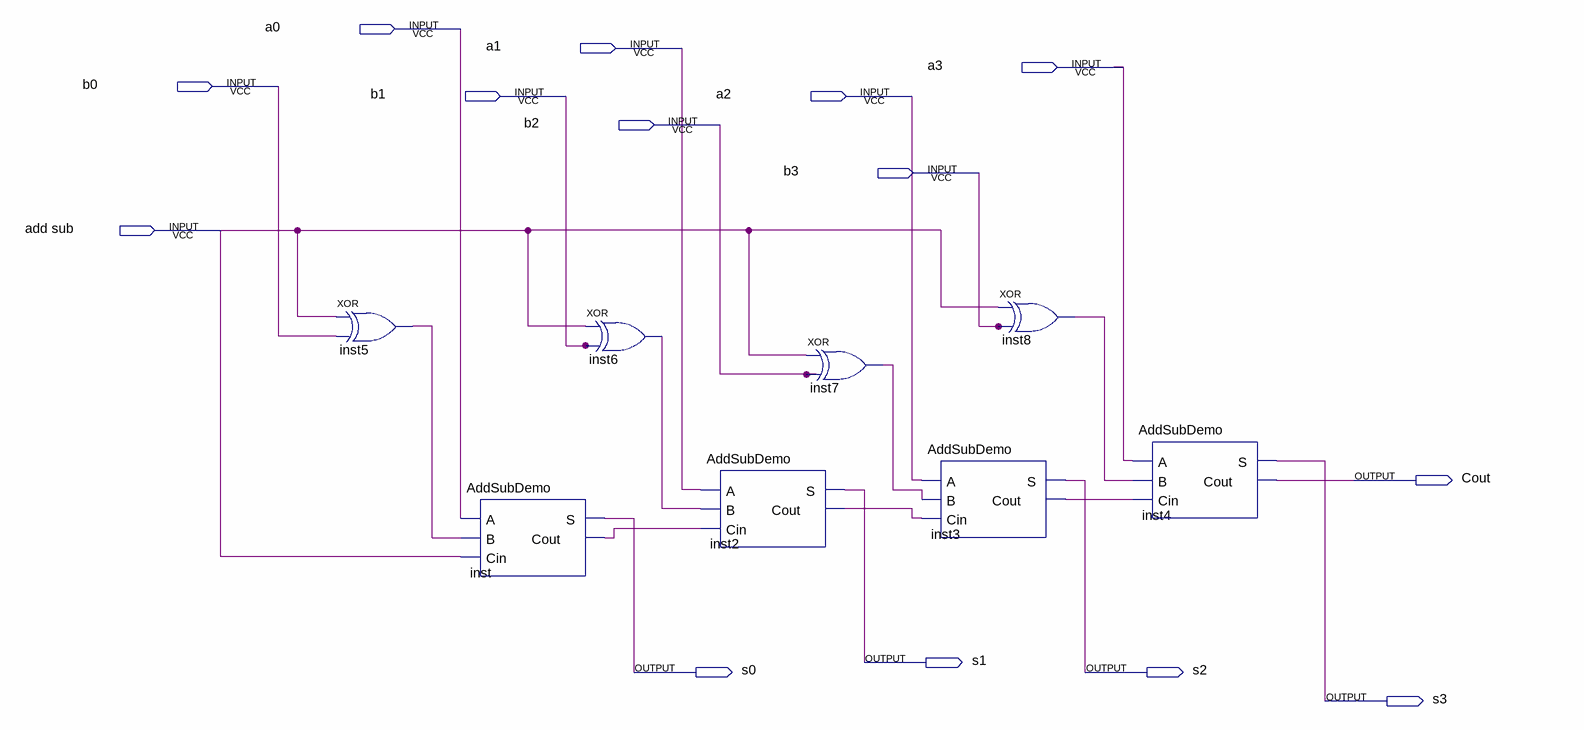
[diagram p0: schematic sheet]
// Quartus schematic Block4.bdf as structural Verilog: 8 symbols, 14 pins
module Block4 (
  input  a0,
  input  a1,
  input  a3,
  input  b0,
  input  b1,
  input  a2,
  input  b2,
  input  b3,
  input  \add_sub ,
  output Cout,
  output s1,
  output s0,
  output s2,
  output s3
);

  wire inst2_cout, inst3_cout, inst5_out, inst6_out, inst7_out, inst8_out, inst_cout;

  xor inst5 (inst5_out, \add_sub , b0);
  AddSubDemo inst (.A(a0), .B(inst5_out), .Cin(\add_sub ), .S(s0), .Cout(inst_cout));
  xor inst6 (inst6_out, \add_sub , b1);
  AddSubDemo inst2 (.A(a1), .B(inst6_out), .Cin(inst_cout), .S(s1), .Cout(inst2_cout));
  xor inst7 (inst7_out, \add_sub , b2);
  AddSubDemo inst3 (.A(a2), .B(inst7_out), .Cin(inst2_cout), .S(s2), .Cout(inst3_cout));
  xor inst8 (inst8_out, \add_sub , b3);
  AddSubDemo inst4 (.A(a3), .B(inst8_out), .Cin(inst3_cout), .S(s3), .Cout(Cout));
endmodule
